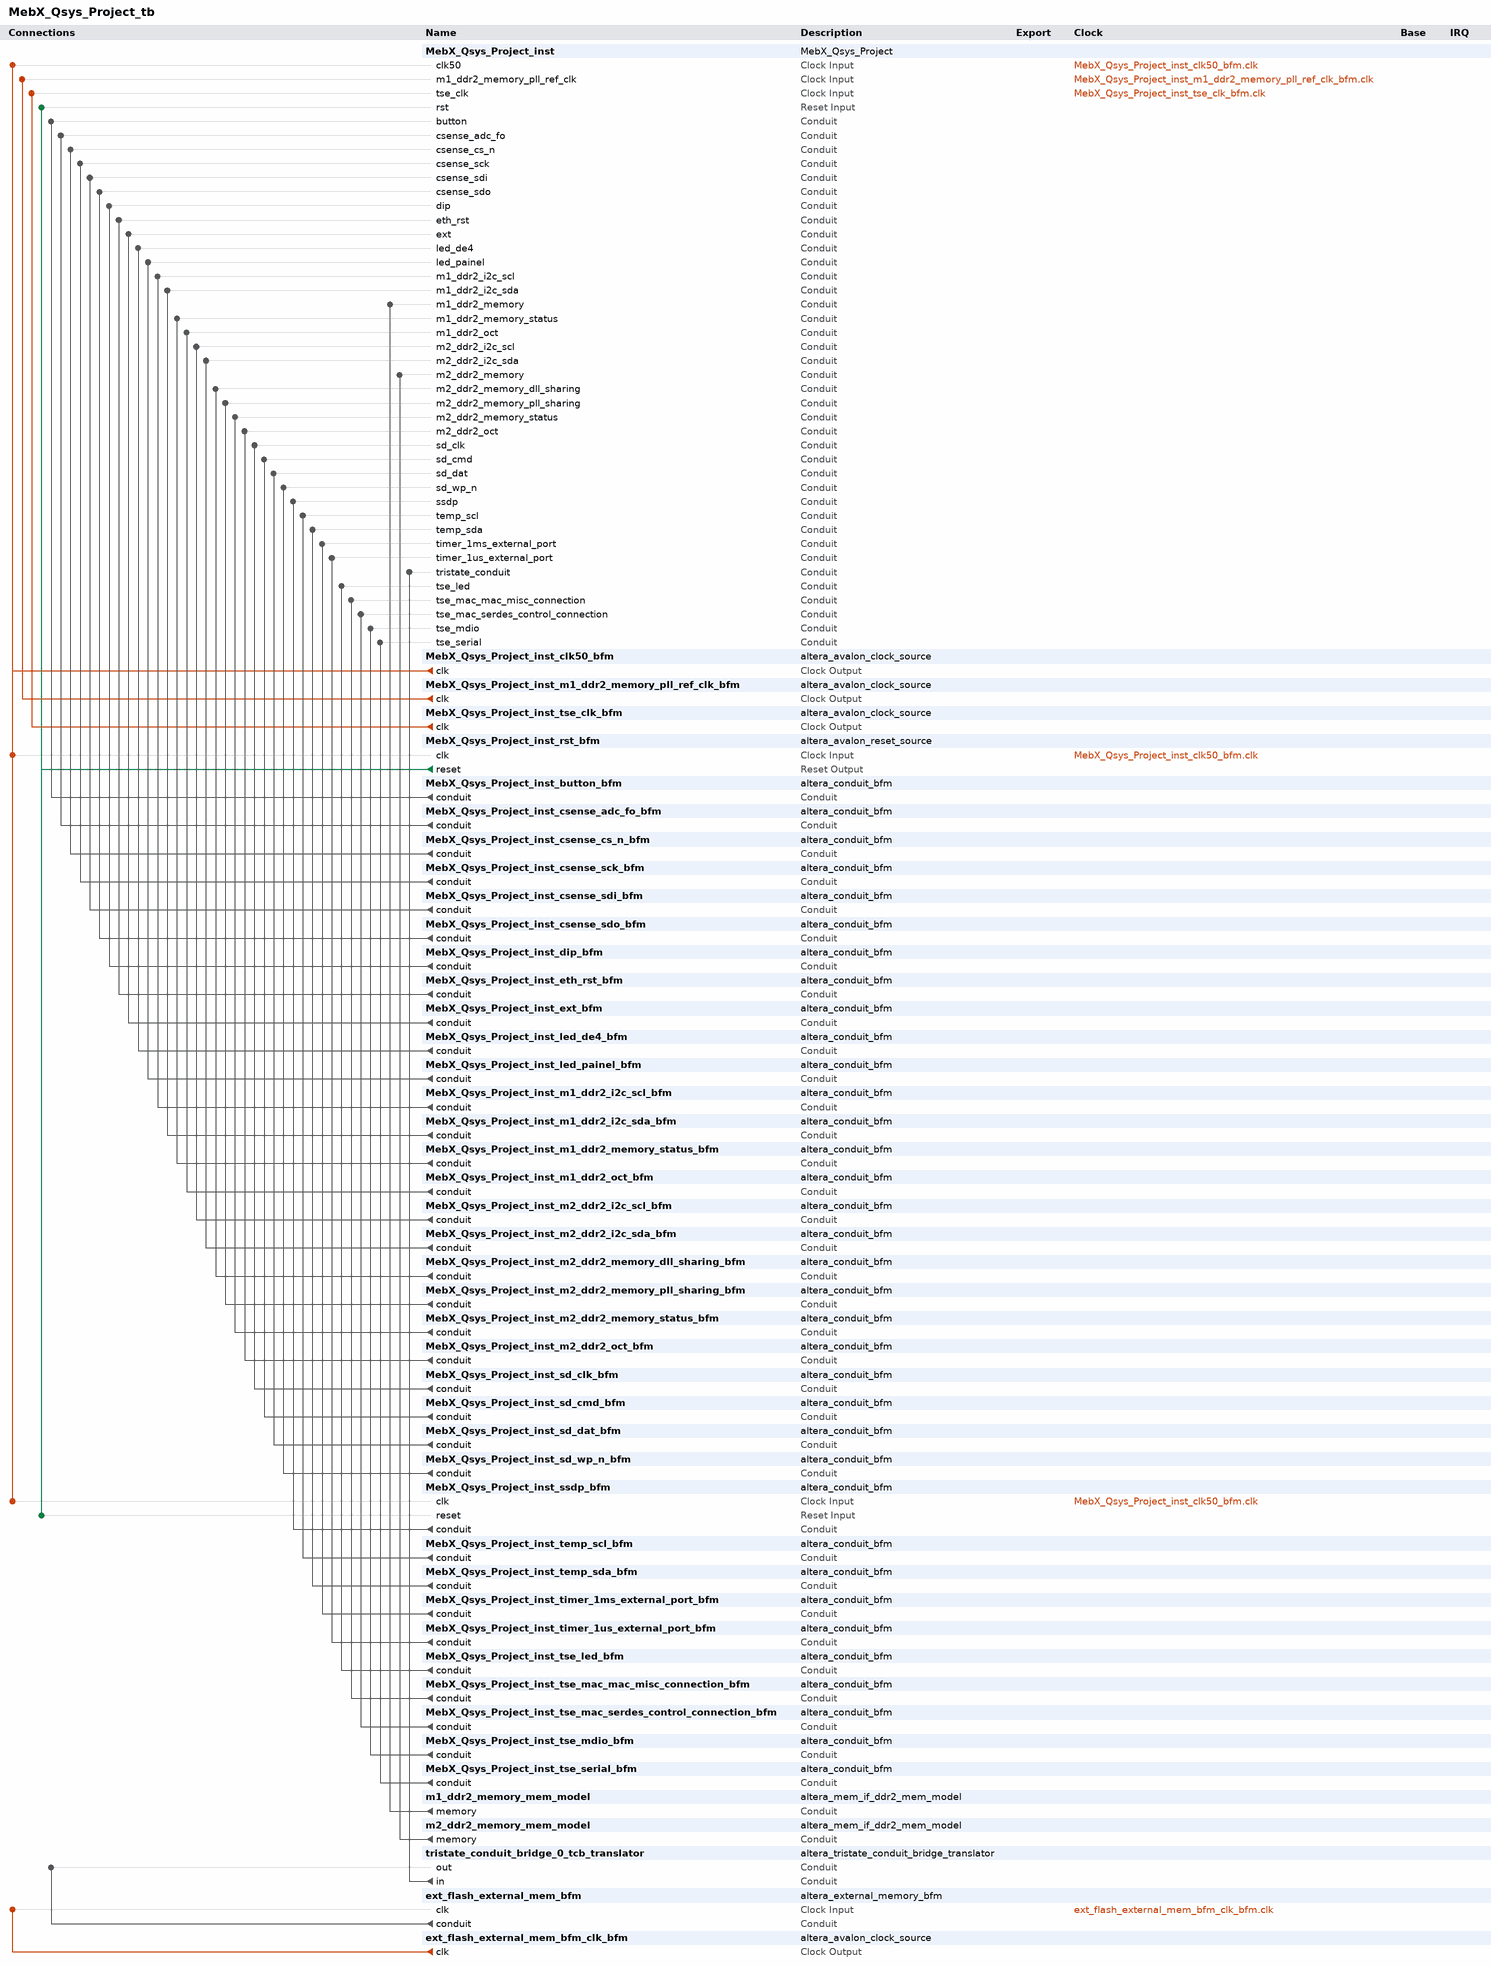
[diagram p0: system contents]
# Platform Designer (Qsys) system MebX_Qsys_Project_tb, Stratix IV EP4SGX230KF40C2
# Parameters at their usual value, and those the tool derives, are not listed.
package require -exact qsys 16.1
create_system MebX_Qsys_Project_tb
set_project_property DEVICE_FAMILY {Stratix IV}
set_project_property DEVICE EP4SGX230KF40C2

add_instance MebX_Qsys_Project_inst MebX_Qsys_Project 1.0

add_instance MebX_Qsys_Project_inst_clk50_bfm altera_avalon_clock_source 16.1

add_instance MebX_Qsys_Project_inst_m1_ddr2_memory_pll_ref_clk_bfm altera_avalon_clock_source 16.1

add_instance MebX_Qsys_Project_inst_tse_clk_bfm altera_avalon_clock_source 16.1

add_instance MebX_Qsys_Project_inst_rst_bfm altera_avalon_reset_source 16.1
set_instance_parameter_value MebX_Qsys_Project_inst_rst_bfm ASSERT_HIGH_RESET 0
set_instance_parameter_value MebX_Qsys_Project_inst_rst_bfm INITIAL_RESET_CYCLES 50

add_instance MebX_Qsys_Project_inst_button_bfm altera_conduit_bfm 16.1
set_instance_parameter_value MebX_Qsys_Project_inst_button_bfm CLOCKED_SIGNAL false
set_instance_parameter_value MebX_Qsys_Project_inst_button_bfm ENABLE_RESET false
set_instance_parameter_value MebX_Qsys_Project_inst_button_bfm SIGNAL_DIRECTIONS output
set_instance_parameter_value MebX_Qsys_Project_inst_button_bfm SIGNAL_WIDTHS 4

add_instance MebX_Qsys_Project_inst_csense_adc_fo_bfm altera_conduit_bfm 16.1
set_instance_parameter_value MebX_Qsys_Project_inst_csense_adc_fo_bfm CLOCKED_SIGNAL false
set_instance_parameter_value MebX_Qsys_Project_inst_csense_adc_fo_bfm ENABLE_RESET false
set_instance_parameter_value MebX_Qsys_Project_inst_csense_adc_fo_bfm SIGNAL_DIRECTIONS input
set_instance_parameter_value MebX_Qsys_Project_inst_csense_adc_fo_bfm SIGNAL_WIDTHS 1

add_instance MebX_Qsys_Project_inst_csense_cs_n_bfm altera_conduit_bfm 16.1
set_instance_parameter_value MebX_Qsys_Project_inst_csense_cs_n_bfm CLOCKED_SIGNAL false
set_instance_parameter_value MebX_Qsys_Project_inst_csense_cs_n_bfm ENABLE_RESET false
set_instance_parameter_value MebX_Qsys_Project_inst_csense_cs_n_bfm SIGNAL_DIRECTIONS input
set_instance_parameter_value MebX_Qsys_Project_inst_csense_cs_n_bfm SIGNAL_WIDTHS 2

add_instance MebX_Qsys_Project_inst_csense_sck_bfm altera_conduit_bfm 16.1
set_instance_parameter_value MebX_Qsys_Project_inst_csense_sck_bfm CLOCKED_SIGNAL false
set_instance_parameter_value MebX_Qsys_Project_inst_csense_sck_bfm ENABLE_RESET false
set_instance_parameter_value MebX_Qsys_Project_inst_csense_sck_bfm SIGNAL_DIRECTIONS input
set_instance_parameter_value MebX_Qsys_Project_inst_csense_sck_bfm SIGNAL_WIDTHS 1

add_instance MebX_Qsys_Project_inst_csense_sdi_bfm altera_conduit_bfm 16.1
set_instance_parameter_value MebX_Qsys_Project_inst_csense_sdi_bfm CLOCKED_SIGNAL false
set_instance_parameter_value MebX_Qsys_Project_inst_csense_sdi_bfm ENABLE_RESET false
set_instance_parameter_value MebX_Qsys_Project_inst_csense_sdi_bfm SIGNAL_DIRECTIONS input
set_instance_parameter_value MebX_Qsys_Project_inst_csense_sdi_bfm SIGNAL_WIDTHS 1

add_instance MebX_Qsys_Project_inst_csense_sdo_bfm altera_conduit_bfm 16.1
set_instance_parameter_value MebX_Qsys_Project_inst_csense_sdo_bfm CLOCKED_SIGNAL false
set_instance_parameter_value MebX_Qsys_Project_inst_csense_sdo_bfm ENABLE_RESET false
set_instance_parameter_value MebX_Qsys_Project_inst_csense_sdo_bfm SIGNAL_DIRECTIONS output
set_instance_parameter_value MebX_Qsys_Project_inst_csense_sdo_bfm SIGNAL_WIDTHS 1

add_instance MebX_Qsys_Project_inst_dip_bfm altera_conduit_bfm 16.1
set_instance_parameter_value MebX_Qsys_Project_inst_dip_bfm CLOCKED_SIGNAL false
set_instance_parameter_value MebX_Qsys_Project_inst_dip_bfm ENABLE_RESET false
set_instance_parameter_value MebX_Qsys_Project_inst_dip_bfm SIGNAL_DIRECTIONS output
set_instance_parameter_value MebX_Qsys_Project_inst_dip_bfm SIGNAL_WIDTHS 8

add_instance MebX_Qsys_Project_inst_eth_rst_bfm altera_conduit_bfm 16.1
set_instance_parameter_value MebX_Qsys_Project_inst_eth_rst_bfm CLOCKED_SIGNAL false
set_instance_parameter_value MebX_Qsys_Project_inst_eth_rst_bfm ENABLE_RESET false
set_instance_parameter_value MebX_Qsys_Project_inst_eth_rst_bfm SIGNAL_DIRECTIONS input
set_instance_parameter_value MebX_Qsys_Project_inst_eth_rst_bfm SIGNAL_WIDTHS 1

add_instance MebX_Qsys_Project_inst_ext_bfm altera_conduit_bfm 16.1
set_instance_parameter_value MebX_Qsys_Project_inst_ext_bfm CLOCKED_SIGNAL false
set_instance_parameter_value MebX_Qsys_Project_inst_ext_bfm ENABLE_RESET false
set_instance_parameter_value MebX_Qsys_Project_inst_ext_bfm SIGNAL_DIRECTIONS output
set_instance_parameter_value MebX_Qsys_Project_inst_ext_bfm SIGNAL_WIDTHS 1

add_instance MebX_Qsys_Project_inst_led_de4_bfm altera_conduit_bfm 16.1
set_instance_parameter_value MebX_Qsys_Project_inst_led_de4_bfm CLOCKED_SIGNAL false
set_instance_parameter_value MebX_Qsys_Project_inst_led_de4_bfm ENABLE_RESET false
set_instance_parameter_value MebX_Qsys_Project_inst_led_de4_bfm SIGNAL_DIRECTIONS input
set_instance_parameter_value MebX_Qsys_Project_inst_led_de4_bfm SIGNAL_WIDTHS 8

add_instance MebX_Qsys_Project_inst_led_painel_bfm altera_conduit_bfm 16.1
set_instance_parameter_value MebX_Qsys_Project_inst_led_painel_bfm CLOCKED_SIGNAL false
set_instance_parameter_value MebX_Qsys_Project_inst_led_painel_bfm ENABLE_RESET false
set_instance_parameter_value MebX_Qsys_Project_inst_led_painel_bfm SIGNAL_DIRECTIONS input
set_instance_parameter_value MebX_Qsys_Project_inst_led_painel_bfm SIGNAL_WIDTHS 13

add_instance MebX_Qsys_Project_inst_m1_ddr2_i2c_scl_bfm altera_conduit_bfm 16.1
set_instance_parameter_value MebX_Qsys_Project_inst_m1_ddr2_i2c_scl_bfm CLOCKED_SIGNAL false
set_instance_parameter_value MebX_Qsys_Project_inst_m1_ddr2_i2c_scl_bfm ENABLE_RESET false
set_instance_parameter_value MebX_Qsys_Project_inst_m1_ddr2_i2c_scl_bfm SIGNAL_DIRECTIONS input
set_instance_parameter_value MebX_Qsys_Project_inst_m1_ddr2_i2c_scl_bfm SIGNAL_WIDTHS 1

add_instance MebX_Qsys_Project_inst_m1_ddr2_i2c_sda_bfm altera_conduit_bfm 16.1
set_instance_parameter_value MebX_Qsys_Project_inst_m1_ddr2_i2c_sda_bfm CLOCKED_SIGNAL false
set_instance_parameter_value MebX_Qsys_Project_inst_m1_ddr2_i2c_sda_bfm ENABLE_RESET false
set_instance_parameter_value MebX_Qsys_Project_inst_m1_ddr2_i2c_sda_bfm SIGNAL_DIRECTIONS bidir
set_instance_parameter_value MebX_Qsys_Project_inst_m1_ddr2_i2c_sda_bfm SIGNAL_WIDTHS 1

add_instance MebX_Qsys_Project_inst_m1_ddr2_memory_status_bfm altera_conduit_bfm 16.1
set_instance_parameter_value MebX_Qsys_Project_inst_m1_ddr2_memory_status_bfm CLOCKED_SIGNAL false
set_instance_parameter_value MebX_Qsys_Project_inst_m1_ddr2_memory_status_bfm ENABLE_RESET false
set_instance_parameter_value MebX_Qsys_Project_inst_m1_ddr2_memory_status_bfm SIGNAL_DIRECTIONS input,input,input
set_instance_parameter_value MebX_Qsys_Project_inst_m1_ddr2_memory_status_bfm SIGNAL_ROLES local_init_done,local_cal_success,local_cal_fail
set_instance_parameter_value MebX_Qsys_Project_inst_m1_ddr2_memory_status_bfm SIGNAL_WIDTHS 1,1,1

add_instance MebX_Qsys_Project_inst_m1_ddr2_oct_bfm altera_conduit_bfm 16.1
set_instance_parameter_value MebX_Qsys_Project_inst_m1_ddr2_oct_bfm CLOCKED_SIGNAL false
set_instance_parameter_value MebX_Qsys_Project_inst_m1_ddr2_oct_bfm ENABLE_RESET false
set_instance_parameter_value MebX_Qsys_Project_inst_m1_ddr2_oct_bfm SIGNAL_DIRECTIONS output,output
set_instance_parameter_value MebX_Qsys_Project_inst_m1_ddr2_oct_bfm SIGNAL_ROLES rdn,rup
set_instance_parameter_value MebX_Qsys_Project_inst_m1_ddr2_oct_bfm SIGNAL_WIDTHS 1,1

add_instance MebX_Qsys_Project_inst_m2_ddr2_i2c_scl_bfm altera_conduit_bfm 16.1
set_instance_parameter_value MebX_Qsys_Project_inst_m2_ddr2_i2c_scl_bfm CLOCKED_SIGNAL false
set_instance_parameter_value MebX_Qsys_Project_inst_m2_ddr2_i2c_scl_bfm ENABLE_RESET false
set_instance_parameter_value MebX_Qsys_Project_inst_m2_ddr2_i2c_scl_bfm SIGNAL_DIRECTIONS input
set_instance_parameter_value MebX_Qsys_Project_inst_m2_ddr2_i2c_scl_bfm SIGNAL_WIDTHS 1

add_instance MebX_Qsys_Project_inst_m2_ddr2_i2c_sda_bfm altera_conduit_bfm 16.1
set_instance_parameter_value MebX_Qsys_Project_inst_m2_ddr2_i2c_sda_bfm CLOCKED_SIGNAL false
set_instance_parameter_value MebX_Qsys_Project_inst_m2_ddr2_i2c_sda_bfm ENABLE_RESET false
set_instance_parameter_value MebX_Qsys_Project_inst_m2_ddr2_i2c_sda_bfm SIGNAL_DIRECTIONS bidir
set_instance_parameter_value MebX_Qsys_Project_inst_m2_ddr2_i2c_sda_bfm SIGNAL_WIDTHS 1

add_instance MebX_Qsys_Project_inst_m2_ddr2_memory_dll_sharing_bfm altera_conduit_bfm 16.1
set_instance_parameter_value MebX_Qsys_Project_inst_m2_ddr2_memory_dll_sharing_bfm CLOCKED_SIGNAL false
set_instance_parameter_value MebX_Qsys_Project_inst_m2_ddr2_memory_dll_sharing_bfm ENABLE_RESET false
set_instance_parameter_value MebX_Qsys_Project_inst_m2_ddr2_memory_dll_sharing_bfm SIGNAL_DIRECTIONS output,input
set_instance_parameter_value MebX_Qsys_Project_inst_m2_ddr2_memory_dll_sharing_bfm SIGNAL_ROLES dll_pll_locked,dll_delayctrl
set_instance_parameter_value MebX_Qsys_Project_inst_m2_ddr2_memory_dll_sharing_bfm SIGNAL_WIDTHS 1,6

add_instance MebX_Qsys_Project_inst_m2_ddr2_memory_pll_sharing_bfm altera_conduit_bfm 16.1
set_instance_parameter_value MebX_Qsys_Project_inst_m2_ddr2_memory_pll_sharing_bfm CLOCKED_SIGNAL false
set_instance_parameter_value MebX_Qsys_Project_inst_m2_ddr2_memory_pll_sharing_bfm ENABLE_RESET false
set_instance_parameter_value MebX_Qsys_Project_inst_m2_ddr2_memory_pll_sharing_bfm SIGNAL_DIRECTIONS input,input,input,input,input,input,input
set_instance_parameter_value MebX_Qsys_Project_inst_m2_ddr2_memory_pll_sharing_bfm SIGNAL_ROLES pll_mem_clk,pll_write_clk,pll_locked,pll_write_clk_pre_phy_clk,pll_addr_cmd_clk,pll_avl_clk,pll_config_clk
set_instance_parameter_value MebX_Qsys_Project_inst_m2_ddr2_memory_pll_sharing_bfm SIGNAL_WIDTHS 1,1,1,1,1,1,1

add_instance MebX_Qsys_Project_inst_m2_ddr2_memory_status_bfm altera_conduit_bfm 16.1
set_instance_parameter_value MebX_Qsys_Project_inst_m2_ddr2_memory_status_bfm CLOCKED_SIGNAL false
set_instance_parameter_value MebX_Qsys_Project_inst_m2_ddr2_memory_status_bfm ENABLE_RESET false
set_instance_parameter_value MebX_Qsys_Project_inst_m2_ddr2_memory_status_bfm SIGNAL_DIRECTIONS input,input,input
set_instance_parameter_value MebX_Qsys_Project_inst_m2_ddr2_memory_status_bfm SIGNAL_ROLES local_init_done,local_cal_success,local_cal_fail
set_instance_parameter_value MebX_Qsys_Project_inst_m2_ddr2_memory_status_bfm SIGNAL_WIDTHS 1,1,1

add_instance MebX_Qsys_Project_inst_m2_ddr2_oct_bfm altera_conduit_bfm 16.1
set_instance_parameter_value MebX_Qsys_Project_inst_m2_ddr2_oct_bfm CLOCKED_SIGNAL false
set_instance_parameter_value MebX_Qsys_Project_inst_m2_ddr2_oct_bfm ENABLE_RESET false
set_instance_parameter_value MebX_Qsys_Project_inst_m2_ddr2_oct_bfm SIGNAL_DIRECTIONS output,output
set_instance_parameter_value MebX_Qsys_Project_inst_m2_ddr2_oct_bfm SIGNAL_ROLES rdn,rup
set_instance_parameter_value MebX_Qsys_Project_inst_m2_ddr2_oct_bfm SIGNAL_WIDTHS 1,1

add_instance MebX_Qsys_Project_inst_sd_clk_bfm altera_conduit_bfm 16.1
set_instance_parameter_value MebX_Qsys_Project_inst_sd_clk_bfm CLOCKED_SIGNAL false
set_instance_parameter_value MebX_Qsys_Project_inst_sd_clk_bfm ENABLE_RESET false
set_instance_parameter_value MebX_Qsys_Project_inst_sd_clk_bfm SIGNAL_DIRECTIONS input
set_instance_parameter_value MebX_Qsys_Project_inst_sd_clk_bfm SIGNAL_WIDTHS 1

add_instance MebX_Qsys_Project_inst_sd_cmd_bfm altera_conduit_bfm 16.1
set_instance_parameter_value MebX_Qsys_Project_inst_sd_cmd_bfm CLOCKED_SIGNAL false
set_instance_parameter_value MebX_Qsys_Project_inst_sd_cmd_bfm ENABLE_RESET false
set_instance_parameter_value MebX_Qsys_Project_inst_sd_cmd_bfm SIGNAL_DIRECTIONS bidir
set_instance_parameter_value MebX_Qsys_Project_inst_sd_cmd_bfm SIGNAL_WIDTHS 1

add_instance MebX_Qsys_Project_inst_sd_dat_bfm altera_conduit_bfm 16.1
set_instance_parameter_value MebX_Qsys_Project_inst_sd_dat_bfm CLOCKED_SIGNAL false
set_instance_parameter_value MebX_Qsys_Project_inst_sd_dat_bfm ENABLE_RESET false
set_instance_parameter_value MebX_Qsys_Project_inst_sd_dat_bfm SIGNAL_DIRECTIONS bidir
set_instance_parameter_value MebX_Qsys_Project_inst_sd_dat_bfm SIGNAL_WIDTHS 4

add_instance MebX_Qsys_Project_inst_sd_wp_n_bfm altera_conduit_bfm 16.1
set_instance_parameter_value MebX_Qsys_Project_inst_sd_wp_n_bfm CLOCKED_SIGNAL false
set_instance_parameter_value MebX_Qsys_Project_inst_sd_wp_n_bfm ENABLE_RESET false
set_instance_parameter_value MebX_Qsys_Project_inst_sd_wp_n_bfm SIGNAL_DIRECTIONS output
set_instance_parameter_value MebX_Qsys_Project_inst_sd_wp_n_bfm SIGNAL_WIDTHS 1

add_instance MebX_Qsys_Project_inst_ssdp_bfm altera_conduit_bfm 16.1
set_instance_parameter_value MebX_Qsys_Project_inst_ssdp_bfm CLOCKED_SIGNAL true
set_instance_parameter_value MebX_Qsys_Project_inst_ssdp_bfm ENABLE_RESET true
set_instance_parameter_value MebX_Qsys_Project_inst_ssdp_bfm SIGNAL_DIRECTIONS input,input
set_instance_parameter_value MebX_Qsys_Project_inst_ssdp_bfm SIGNAL_ROLES ssdp0,ssdp1
set_instance_parameter_value MebX_Qsys_Project_inst_ssdp_bfm SIGNAL_WIDTHS 8,8

add_instance MebX_Qsys_Project_inst_temp_scl_bfm altera_conduit_bfm 16.1
set_instance_parameter_value MebX_Qsys_Project_inst_temp_scl_bfm CLOCKED_SIGNAL false
set_instance_parameter_value MebX_Qsys_Project_inst_temp_scl_bfm ENABLE_RESET false
set_instance_parameter_value MebX_Qsys_Project_inst_temp_scl_bfm SIGNAL_DIRECTIONS input
set_instance_parameter_value MebX_Qsys_Project_inst_temp_scl_bfm SIGNAL_WIDTHS 1

add_instance MebX_Qsys_Project_inst_temp_sda_bfm altera_conduit_bfm 16.1
set_instance_parameter_value MebX_Qsys_Project_inst_temp_sda_bfm CLOCKED_SIGNAL false
set_instance_parameter_value MebX_Qsys_Project_inst_temp_sda_bfm ENABLE_RESET false
set_instance_parameter_value MebX_Qsys_Project_inst_temp_sda_bfm SIGNAL_DIRECTIONS bidir
set_instance_parameter_value MebX_Qsys_Project_inst_temp_sda_bfm SIGNAL_WIDTHS 1

add_instance MebX_Qsys_Project_inst_timer_1ms_external_port_bfm altera_conduit_bfm 16.1
set_instance_parameter_value MebX_Qsys_Project_inst_timer_1ms_external_port_bfm CLOCKED_SIGNAL false
set_instance_parameter_value MebX_Qsys_Project_inst_timer_1ms_external_port_bfm ENABLE_RESET false
set_instance_parameter_value MebX_Qsys_Project_inst_timer_1ms_external_port_bfm SIGNAL_DIRECTIONS input
set_instance_parameter_value MebX_Qsys_Project_inst_timer_1ms_external_port_bfm SIGNAL_WIDTHS 1

add_instance MebX_Qsys_Project_inst_timer_1us_external_port_bfm altera_conduit_bfm 16.1
set_instance_parameter_value MebX_Qsys_Project_inst_timer_1us_external_port_bfm CLOCKED_SIGNAL false
set_instance_parameter_value MebX_Qsys_Project_inst_timer_1us_external_port_bfm ENABLE_RESET false
set_instance_parameter_value MebX_Qsys_Project_inst_timer_1us_external_port_bfm SIGNAL_DIRECTIONS input
set_instance_parameter_value MebX_Qsys_Project_inst_timer_1us_external_port_bfm SIGNAL_WIDTHS 1

add_instance MebX_Qsys_Project_inst_tse_led_bfm altera_conduit_bfm 16.1
set_instance_parameter_value MebX_Qsys_Project_inst_tse_led_bfm CLOCKED_SIGNAL false
set_instance_parameter_value MebX_Qsys_Project_inst_tse_led_bfm ENABLE_RESET false
set_instance_parameter_value MebX_Qsys_Project_inst_tse_led_bfm SIGNAL_DIRECTIONS input,input,input,input,input,input,input
set_instance_parameter_value MebX_Qsys_Project_inst_tse_led_bfm SIGNAL_ROLES crs,link,panel_link,col,an,char_err,disp_err
set_instance_parameter_value MebX_Qsys_Project_inst_tse_led_bfm SIGNAL_WIDTHS 1,1,1,1,1,1,1

add_instance MebX_Qsys_Project_inst_tse_mac_mac_misc_connection_bfm altera_conduit_bfm 16.1
set_instance_parameter_value MebX_Qsys_Project_inst_tse_mac_mac_misc_connection_bfm CLOCKED_SIGNAL false
set_instance_parameter_value MebX_Qsys_Project_inst_tse_mac_mac_misc_connection_bfm ENABLE_RESET false
set_instance_parameter_value MebX_Qsys_Project_inst_tse_mac_mac_misc_connection_bfm SIGNAL_DIRECTIONS output,output,input,output,output,input,input,input,input,input,input,input,input,input
set_instance_parameter_value MebX_Qsys_Project_inst_tse_mac_mac_misc_connection_bfm SIGNAL_ROLES xon_gen,xoff_gen,magic_wakeup,magic_sleep_n,ff_tx_crc_fwd,ff_tx_septy,tx_ff_uflow,ff_tx_a_full,ff_tx_a_empty,rx_err_stat,rx_frm_type,ff_rx_dsav,ff_rx_a_full,ff_rx_a_empty
set_instance_parameter_value MebX_Qsys_Project_inst_tse_mac_mac_misc_connection_bfm SIGNAL_WIDTHS 1,1,1,1,1,1,1,1,1,18,4,1,1,1

add_instance MebX_Qsys_Project_inst_tse_mac_serdes_control_connection_bfm altera_conduit_bfm 16.1
set_instance_parameter_value MebX_Qsys_Project_inst_tse_mac_serdes_control_connection_bfm CLOCKED_SIGNAL false
set_instance_parameter_value MebX_Qsys_Project_inst_tse_mac_serdes_control_connection_bfm ENABLE_RESET false
set_instance_parameter_value MebX_Qsys_Project_inst_tse_mac_serdes_control_connection_bfm SIGNAL_DIRECTIONS input
set_instance_parameter_value MebX_Qsys_Project_inst_tse_mac_serdes_control_connection_bfm SIGNAL_WIDTHS 1

add_instance MebX_Qsys_Project_inst_tse_mdio_bfm altera_conduit_bfm 16.1
set_instance_parameter_value MebX_Qsys_Project_inst_tse_mdio_bfm CLOCKED_SIGNAL false
set_instance_parameter_value MebX_Qsys_Project_inst_tse_mdio_bfm ENABLE_RESET false
set_instance_parameter_value MebX_Qsys_Project_inst_tse_mdio_bfm SIGNAL_DIRECTIONS input,output,input,input
set_instance_parameter_value MebX_Qsys_Project_inst_tse_mdio_bfm SIGNAL_ROLES mdc,mdio_in,mdio_out,mdio_oen
set_instance_parameter_value MebX_Qsys_Project_inst_tse_mdio_bfm SIGNAL_WIDTHS 1,1,1,1

add_instance MebX_Qsys_Project_inst_tse_serial_bfm altera_conduit_bfm 16.1
set_instance_parameter_value MebX_Qsys_Project_inst_tse_serial_bfm CLOCKED_SIGNAL false
set_instance_parameter_value MebX_Qsys_Project_inst_tse_serial_bfm ENABLE_RESET false
set_instance_parameter_value MebX_Qsys_Project_inst_tse_serial_bfm SIGNAL_DIRECTIONS input,output
set_instance_parameter_value MebX_Qsys_Project_inst_tse_serial_bfm SIGNAL_ROLES txp,rxp
set_instance_parameter_value MebX_Qsys_Project_inst_tse_serial_bfm SIGNAL_WIDTHS 1,1

add_instance m1_ddr2_memory_mem_model altera_mem_if_ddr2_mem_model 16.1
set_instance_parameter_value m1_ddr2_memory_mem_model ALTMEMPHY_COMPATIBLE_MODE false
set_instance_parameter_value m1_ddr2_memory_mem_model AP_MODE false
set_instance_parameter_value m1_ddr2_memory_mem_model AP_MODE_EN 0
set_instance_parameter_value m1_ddr2_memory_mem_model CFG_TCCD_NS 2.5
set_instance_parameter_value m1_ddr2_memory_mem_model CUT_NEW_FAMILY_TIMING true
set_instance_parameter_value m1_ddr2_memory_mem_model DAT_DATA_WIDTH 32
set_instance_parameter_value m1_ddr2_memory_mem_model DEVICE_DEPTH 1
set_instance_parameter_value m1_ddr2_memory_mem_model DISABLE_CHILD_MESSAGING false
set_instance_parameter_value m1_ddr2_memory_mem_model DISCRETE_FLY_BY true
set_instance_parameter_value m1_ddr2_memory_mem_model DUPLICATE_AC false
set_instance_parameter_value m1_ddr2_memory_mem_model FORCE_DQS_TRACKING AUTO
set_instance_parameter_value m1_ddr2_memory_mem_model FORCE_SHADOW_REGS AUTO
set_instance_parameter_value m1_ddr2_memory_mem_model HARD_EMIF false
set_instance_parameter_value m1_ddr2_memory_mem_model HHP_HPS false
set_instance_parameter_value m1_ddr2_memory_mem_model HHP_HPS_SIMULATION false
set_instance_parameter_value m1_ddr2_memory_mem_model HHP_HPS_VERIFICATION false
set_instance_parameter_value m1_ddr2_memory_mem_model HPS_PROTOCOL DEFAULT
set_instance_parameter_value m1_ddr2_memory_mem_model IS_ES_DEVICE false
set_instance_parameter_value m1_ddr2_memory_mem_model MEM_ASR Manual
set_instance_parameter_value m1_ddr2_memory_mem_model MEM_ATCL 0
set_instance_parameter_value m1_ddr2_memory_mem_model MEM_AUTO_LEVELING_MODE true
set_instance_parameter_value m1_ddr2_memory_mem_model MEM_BANKADDR_WIDTH 3
set_instance_parameter_value m1_ddr2_memory_mem_model MEM_BL 8
set_instance_parameter_value m1_ddr2_memory_mem_model MEM_BT Sequential
set_instance_parameter_value m1_ddr2_memory_mem_model MEM_CK_WIDTH 2
set_instance_parameter_value m1_ddr2_memory_mem_model MEM_CLK_EN_WIDTH 1
set_instance_parameter_value m1_ddr2_memory_mem_model MEM_CLK_FREQ 400.0
set_instance_parameter_value m1_ddr2_memory_mem_model MEM_CLK_FREQ_MAX 400.0
set_instance_parameter_value m1_ddr2_memory_mem_model MEM_COL_ADDR_WIDTH 10
set_instance_parameter_value m1_ddr2_memory_mem_model MEM_CS_WIDTH 1
set_instance_parameter_value m1_ddr2_memory_mem_model MEM_DLL_EN true
set_instance_parameter_value m1_ddr2_memory_mem_model MEM_DQ_PER_DQS 8
set_instance_parameter_value m1_ddr2_memory_mem_model MEM_DQ_WIDTH 64
set_instance_parameter_value m1_ddr2_memory_mem_model MEM_DRV_STR Full
set_instance_parameter_value m1_ddr2_memory_mem_model MEM_FORMAT UNBUFFERED
set_instance_parameter_value m1_ddr2_memory_mem_model MEM_GUARANTEED_WRITE_INIT false
set_instance_parameter_value m1_ddr2_memory_mem_model MEM_IF_BOARD_BASE_DELAY 10
set_instance_parameter_value m1_ddr2_memory_mem_model MEM_IF_DM_PINS_EN true
set_instance_parameter_value m1_ddr2_memory_mem_model MEM_IF_DQSN_EN true
set_instance_parameter_value m1_ddr2_memory_mem_model MEM_IF_SIM_VALID_WINDOW 0
set_instance_parameter_value m1_ddr2_memory_mem_model MEM_INIT_EN false
set_instance_parameter_value m1_ddr2_memory_mem_model MEM_MIRROR_ADDRESSING 0
set_instance_parameter_value m1_ddr2_memory_mem_model MEM_NUMBER_OF_DIMMS 1
set_instance_parameter_value m1_ddr2_memory_mem_model MEM_NUMBER_OF_RANKS_PER_DEVICE 1
set_instance_parameter_value m1_ddr2_memory_mem_model MEM_NUMBER_OF_RANKS_PER_DIMM 1
set_instance_parameter_value m1_ddr2_memory_mem_model MEM_PD {Fast exit}
set_instance_parameter_value m1_ddr2_memory_mem_model MEM_RANK_MULTIPLICATION_FACTOR 1
set_instance_parameter_value m1_ddr2_memory_mem_model MEM_ROW_ADDR_WIDTH 14
set_instance_parameter_value m1_ddr2_memory_mem_model MEM_RTT_NOM 50
set_instance_parameter_value m1_ddr2_memory_mem_model MEM_SRT {2x refresh rate}
set_instance_parameter_value m1_ddr2_memory_mem_model MEM_TCL 6
set_instance_parameter_value m1_ddr2_memory_mem_model MEM_TFAW_NS 37.5
set_instance_parameter_value m1_ddr2_memory_mem_model MEM_TINIT_US 200
set_instance_parameter_value m1_ddr2_memory_mem_model MEM_TMRD_CK 5
set_instance_parameter_value m1_ddr2_memory_mem_model MEM_TRAS_NS 40.0
set_instance_parameter_value m1_ddr2_memory_mem_model MEM_TRCD_NS 15.0
set_instance_parameter_value m1_ddr2_memory_mem_model MEM_TREFI_US 7.8
set_instance_parameter_value m1_ddr2_memory_mem_model MEM_TRFC_NS 127.5
set_instance_parameter_value m1_ddr2_memory_mem_model MEM_TRP_NS 15.0
set_instance_parameter_value m1_ddr2_memory_mem_model MEM_TRRD_NS 7.5
set_instance_parameter_value m1_ddr2_memory_mem_model MEM_TRTP_NS 7.5
set_instance_parameter_value m1_ddr2_memory_mem_model MEM_TWR_NS 15.0
set_instance_parameter_value m1_ddr2_memory_mem_model MEM_TWTR 3
set_instance_parameter_value m1_ddr2_memory_mem_model MEM_USER_LEVELING_MODE Leveling
set_instance_parameter_value m1_ddr2_memory_mem_model MEM_VENDOR Micron
set_instance_parameter_value m1_ddr2_memory_mem_model MEM_VERBOSE true
set_instance_parameter_value m1_ddr2_memory_mem_model MRS_MIRROR_PING_PONG_ATSO false
set_instance_parameter_value m1_ddr2_memory_mem_model NEXTGEN true
set_instance_parameter_value m1_ddr2_memory_mem_model PARSE_FRIENDLY_DEVICE_FAMILY_PARAM_VALID false
set_instance_parameter_value m1_ddr2_memory_mem_model PINGPONGPHY_EN false
set_instance_parameter_value m1_ddr2_memory_mem_model RATE Half
set_instance_parameter_value m1_ddr2_memory_mem_model REFRESH_BURST_VALIDATION false
set_instance_parameter_value m1_ddr2_memory_mem_model SPEED_GRADE 2
set_instance_parameter_value m1_ddr2_memory_mem_model TIMING_TDH 250
set_instance_parameter_value m1_ddr2_memory_mem_model TIMING_TDQSCK 350
set_instance_parameter_value m1_ddr2_memory_mem_model TIMING_TDQSCKDL 1200
set_instance_parameter_value m1_ddr2_memory_mem_model TIMING_TDQSCKDM 900
set_instance_parameter_value m1_ddr2_memory_mem_model TIMING_TDQSCKDS 450
set_instance_parameter_value m1_ddr2_memory_mem_model TIMING_TDQSH 0.35
set_instance_parameter_value m1_ddr2_memory_mem_model TIMING_TDQSQ 200
set_instance_parameter_value m1_ddr2_memory_mem_model TIMING_TDQSS 0.25
set_instance_parameter_value m1_ddr2_memory_mem_model TIMING_TDS 250
set_instance_parameter_value m1_ddr2_memory_mem_model TIMING_TDSH 0.2
set_instance_parameter_value m1_ddr2_memory_mem_model TIMING_TDSS 0.2
set_instance_parameter_value m1_ddr2_memory_mem_model TIMING_TIH 375
set_instance_parameter_value m1_ddr2_memory_mem_model TIMING_TIS 375
set_instance_parameter_value m1_ddr2_memory_mem_model TIMING_TQHS 300
set_instance_parameter_value m1_ddr2_memory_mem_model USE_MEM_CLK_FREQ false

add_instance m2_ddr2_memory_mem_model altera_mem_if_ddr2_mem_model 16.1
set_instance_parameter_value m2_ddr2_memory_mem_model ALTMEMPHY_COMPATIBLE_MODE false
set_instance_parameter_value m2_ddr2_memory_mem_model AP_MODE false
set_instance_parameter_value m2_ddr2_memory_mem_model AP_MODE_EN 0
set_instance_parameter_value m2_ddr2_memory_mem_model CFG_TCCD_NS 2.5
set_instance_parameter_value m2_ddr2_memory_mem_model CUT_NEW_FAMILY_TIMING true
set_instance_parameter_value m2_ddr2_memory_mem_model DAT_DATA_WIDTH 32
set_instance_parameter_value m2_ddr2_memory_mem_model DEVICE_DEPTH 1
set_instance_parameter_value m2_ddr2_memory_mem_model DISABLE_CHILD_MESSAGING false
set_instance_parameter_value m2_ddr2_memory_mem_model DISCRETE_FLY_BY true
set_instance_parameter_value m2_ddr2_memory_mem_model DUPLICATE_AC false
set_instance_parameter_value m2_ddr2_memory_mem_model FORCE_DQS_TRACKING AUTO
set_instance_parameter_value m2_ddr2_memory_mem_model FORCE_SHADOW_REGS AUTO
set_instance_parameter_value m2_ddr2_memory_mem_model HARD_EMIF false
set_instance_parameter_value m2_ddr2_memory_mem_model HHP_HPS false
set_instance_parameter_value m2_ddr2_memory_mem_model HHP_HPS_SIMULATION false
set_instance_parameter_value m2_ddr2_memory_mem_model HHP_HPS_VERIFICATION false
set_instance_parameter_value m2_ddr2_memory_mem_model HPS_PROTOCOL DEFAULT
set_instance_parameter_value m2_ddr2_memory_mem_model IS_ES_DEVICE false
set_instance_parameter_value m2_ddr2_memory_mem_model MEM_ASR Manual
set_instance_parameter_value m2_ddr2_memory_mem_model MEM_ATCL 0
set_instance_parameter_value m2_ddr2_memory_mem_model MEM_AUTO_LEVELING_MODE true
set_instance_parameter_value m2_ddr2_memory_mem_model MEM_BANKADDR_WIDTH 3
set_instance_parameter_value m2_ddr2_memory_mem_model MEM_BL 8
set_instance_parameter_value m2_ddr2_memory_mem_model MEM_BT Sequential
set_instance_parameter_value m2_ddr2_memory_mem_model MEM_CK_WIDTH 2
set_instance_parameter_value m2_ddr2_memory_mem_model MEM_CLK_EN_WIDTH 1
set_instance_parameter_value m2_ddr2_memory_mem_model MEM_CLK_FREQ 400.0
set_instance_parameter_value m2_ddr2_memory_mem_model MEM_CLK_FREQ_MAX 400.0
set_instance_parameter_value m2_ddr2_memory_mem_model MEM_COL_ADDR_WIDTH 10
set_instance_parameter_value m2_ddr2_memory_mem_model MEM_CS_WIDTH 1
set_instance_parameter_value m2_ddr2_memory_mem_model MEM_DLL_EN true
set_instance_parameter_value m2_ddr2_memory_mem_model MEM_DQ_PER_DQS 8
set_instance_parameter_value m2_ddr2_memory_mem_model MEM_DQ_WIDTH 64
set_instance_parameter_value m2_ddr2_memory_mem_model MEM_DRV_STR Full
set_instance_parameter_value m2_ddr2_memory_mem_model MEM_FORMAT UNBUFFERED
set_instance_parameter_value m2_ddr2_memory_mem_model MEM_GUARANTEED_WRITE_INIT false
set_instance_parameter_value m2_ddr2_memory_mem_model MEM_IF_BOARD_BASE_DELAY 10
set_instance_parameter_value m2_ddr2_memory_mem_model MEM_IF_DM_PINS_EN true
set_instance_parameter_value m2_ddr2_memory_mem_model MEM_IF_DQSN_EN true
set_instance_parameter_value m2_ddr2_memory_mem_model MEM_IF_SIM_VALID_WINDOW 0
set_instance_parameter_value m2_ddr2_memory_mem_model MEM_INIT_EN false
set_instance_parameter_value m2_ddr2_memory_mem_model MEM_MIRROR_ADDRESSING 0
set_instance_parameter_value m2_ddr2_memory_mem_model MEM_NUMBER_OF_DIMMS 1
set_instance_parameter_value m2_ddr2_memory_mem_model MEM_NUMBER_OF_RANKS_PER_DEVICE 1
set_instance_parameter_value m2_ddr2_memory_mem_model MEM_NUMBER_OF_RANKS_PER_DIMM 1
set_instance_parameter_value m2_ddr2_memory_mem_model MEM_PD {Fast exit}
set_instance_parameter_value m2_ddr2_memory_mem_model MEM_RANK_MULTIPLICATION_FACTOR 1
set_instance_parameter_value m2_ddr2_memory_mem_model MEM_ROW_ADDR_WIDTH 14
set_instance_parameter_value m2_ddr2_memory_mem_model MEM_RTT_NOM 50
set_instance_parameter_value m2_ddr2_memory_mem_model MEM_SRT {2x refresh rate}
set_instance_parameter_value m2_ddr2_memory_mem_model MEM_TCL 6
set_instance_parameter_value m2_ddr2_memory_mem_model MEM_TFAW_NS 37.5
set_instance_parameter_value m2_ddr2_memory_mem_model MEM_TINIT_US 200
set_instance_parameter_value m2_ddr2_memory_mem_model MEM_TMRD_CK 5
set_instance_parameter_value m2_ddr2_memory_mem_model MEM_TRAS_NS 40.0
set_instance_parameter_value m2_ddr2_memory_mem_model MEM_TRCD_NS 15.0
set_instance_parameter_value m2_ddr2_memory_mem_model MEM_TREFI_US 7.8
set_instance_parameter_value m2_ddr2_memory_mem_model MEM_TRFC_NS 127.5
set_instance_parameter_value m2_ddr2_memory_mem_model MEM_TRP_NS 15.0
set_instance_parameter_value m2_ddr2_memory_mem_model MEM_TRRD_NS 7.5
set_instance_parameter_value m2_ddr2_memory_mem_model MEM_TRTP_NS 7.5
set_instance_parameter_value m2_ddr2_memory_mem_model MEM_TWR_NS 15.0
set_instance_parameter_value m2_ddr2_memory_mem_model MEM_TWTR 3
set_instance_parameter_value m2_ddr2_memory_mem_model MEM_USER_LEVELING_MODE Leveling
set_instance_parameter_value m2_ddr2_memory_mem_model MEM_VENDOR Micron
set_instance_parameter_value m2_ddr2_memory_mem_model MEM_VERBOSE true
set_instance_parameter_value m2_ddr2_memory_mem_model MRS_MIRROR_PING_PONG_ATSO false
set_instance_parameter_value m2_ddr2_memory_mem_model NEXTGEN true
set_instance_parameter_value m2_ddr2_memory_mem_model PARSE_FRIENDLY_DEVICE_FAMILY_PARAM_VALID false
set_instance_parameter_value m2_ddr2_memory_mem_model PINGPONGPHY_EN false
set_instance_parameter_value m2_ddr2_memory_mem_model RATE Half
set_instance_parameter_value m2_ddr2_memory_mem_model REFRESH_BURST_VALIDATION false
set_instance_parameter_value m2_ddr2_memory_mem_model SPEED_GRADE 2
set_instance_parameter_value m2_ddr2_memory_mem_model TIMING_TDH 250
set_instance_parameter_value m2_ddr2_memory_mem_model TIMING_TDQSCK 350
set_instance_parameter_value m2_ddr2_memory_mem_model TIMING_TDQSCKDL 1200
set_instance_parameter_value m2_ddr2_memory_mem_model TIMING_TDQSCKDM 900
set_instance_parameter_value m2_ddr2_memory_mem_model TIMING_TDQSCKDS 450
set_instance_parameter_value m2_ddr2_memory_mem_model TIMING_TDQSH 0.35
set_instance_parameter_value m2_ddr2_memory_mem_model TIMING_TDQSQ 200
set_instance_parameter_value m2_ddr2_memory_mem_model TIMING_TDQSS 0.25
set_instance_parameter_value m2_ddr2_memory_mem_model TIMING_TDS 250
set_instance_parameter_value m2_ddr2_memory_mem_model TIMING_TDSH 0.2
set_instance_parameter_value m2_ddr2_memory_mem_model TIMING_TDSS 0.2
set_instance_parameter_value m2_ddr2_memory_mem_model TIMING_TIH 375
set_instance_parameter_value m2_ddr2_memory_mem_model TIMING_TIS 375
set_instance_parameter_value m2_ddr2_memory_mem_model TIMING_TQHS 300
set_instance_parameter_value m2_ddr2_memory_mem_model USE_MEM_CLK_FREQ false

add_instance tristate_conduit_bridge_0_tcb_translator altera_tristate_conduit_bridge_translator 16.1
set_instance_parameter_value tristate_conduit_bridge_0_tcb_translator CHAIN_LENGTH 4
set_instance_parameter_value tristate_conduit_bridge_0_tcb_translator MODULE_ORIGIN_LIST ext_flash.tcm,ext_flash.tcm,ext_flash.tcm,ext_flash.tcm,ext_flash.tcm
set_instance_parameter_value tristate_conduit_bridge_0_tcb_translator SIGNAL_ORIGIN_LIST tcm_address_out,tcm_read_n_out,tcm_write_n_out,tcm_data_out,tcm_chipselect_n_out
set_instance_parameter_value tristate_conduit_bridge_0_tcb_translator SIGNAL_ORIGIN_TYPE Output,Output,Output,Bidirectional,Output
set_instance_parameter_value tristate_conduit_bridge_0_tcb_translator SIGNAL_ORIGIN_WIDTH 26,1,1,16,1

add_instance ext_flash_external_mem_bfm altera_external_memory_bfm 16.1
set_instance_parameter_value ext_flash_external_mem_bfm ACTIVE_LOW_BEGINTRANSFER 0
set_instance_parameter_value ext_flash_external_mem_bfm ACTIVE_LOW_BYTEENABLE 0
set_instance_parameter_value ext_flash_external_mem_bfm ACTIVE_LOW_CHIPSELECT 1
set_instance_parameter_value ext_flash_external_mem_bfm ACTIVE_LOW_OUTPUTENABLE 0
set_instance_parameter_value ext_flash_external_mem_bfm ACTIVE_LOW_READ 1
set_instance_parameter_value ext_flash_external_mem_bfm ACTIVE_LOW_RESET 0
set_instance_parameter_value ext_flash_external_mem_bfm ACTIVE_LOW_WRITE 1
set_instance_parameter_value ext_flash_external_mem_bfm CDT_ADDRESS_W 26
set_instance_parameter_value ext_flash_external_mem_bfm CDT_NUMSYMBOLS 2
set_instance_parameter_value ext_flash_external_mem_bfm CDT_READ_LATENCY 0
set_instance_parameter_value ext_flash_external_mem_bfm CDT_SYMBOL_W 8
set_instance_parameter_value ext_flash_external_mem_bfm INIT_FILE altera_external_memory_bfm.hex
set_instance_parameter_value ext_flash_external_mem_bfm SIGNAL_ADDRESS_ROLES tcm_address_out
set_instance_parameter_value ext_flash_external_mem_bfm SIGNAL_BEGINTRANSFER_ROLES tcm_begintransfer_out
set_instance_parameter_value ext_flash_external_mem_bfm SIGNAL_BYTEENABLE_ROLES tcm_byteenable_out
set_instance_parameter_value ext_flash_external_mem_bfm SIGNAL_CHIPSELECT_ROLES tcm_chipselect_n_out
set_instance_parameter_value ext_flash_external_mem_bfm SIGNAL_DATA_ROLES tcm_data_out
set_instance_parameter_value ext_flash_external_mem_bfm SIGNAL_OUTPUTENABLE_ROLES tcm_outputenable_out
set_instance_parameter_value ext_flash_external_mem_bfm SIGNAL_READ_ROLES tcm_read_n_out
set_instance_parameter_value ext_flash_external_mem_bfm SIGNAL_RESET_ROLES tcm_reset_out
set_instance_parameter_value ext_flash_external_mem_bfm SIGNAL_WRITE_ROLES tcm_write_n_out
set_instance_parameter_value ext_flash_external_mem_bfm USE_BEGINTRANSFER 0
set_instance_parameter_value ext_flash_external_mem_bfm USE_BYTEENABLE 0
set_instance_parameter_value ext_flash_external_mem_bfm USE_CHIPSELECT 1
set_instance_parameter_value ext_flash_external_mem_bfm USE_OUTPUTENABLE 0
set_instance_parameter_value ext_flash_external_mem_bfm USE_READ 1
set_instance_parameter_value ext_flash_external_mem_bfm USE_RESET 0
set_instance_parameter_value ext_flash_external_mem_bfm USE_WRITE 1
set_instance_parameter_value ext_flash_external_mem_bfm VHDL_ID 0

add_instance ext_flash_external_mem_bfm_clk_bfm altera_avalon_clock_source 16.1
set_instance_parameter_value ext_flash_external_mem_bfm_clk_bfm CLOCK_RATE 100000000

# connections
add_connection ext_flash_external_mem_bfm_clk_bfm.clk ext_flash_external_mem_bfm.clk clock
add_connection MebX_Qsys_Project_inst_clk50_bfm.clk MebX_Qsys_Project_inst.clk50 clock
add_connection MebX_Qsys_Project_inst_clk50_bfm.clk MebX_Qsys_Project_inst_rst_bfm.clk clock
add_connection MebX_Qsys_Project_inst_clk50_bfm.clk MebX_Qsys_Project_inst_ssdp_bfm.clk clock
add_connection MebX_Qsys_Project_inst_m1_ddr2_memory_pll_ref_clk_bfm.clk MebX_Qsys_Project_inst.m1_ddr2_memory_pll_ref_clk clock
add_connection MebX_Qsys_Project_inst_tse_clk_bfm.clk MebX_Qsys_Project_inst.tse_clk clock
add_connection MebX_Qsys_Project_inst_rst_bfm.reset MebX_Qsys_Project_inst.rst reset
add_connection MebX_Qsys_Project_inst_rst_bfm.reset MebX_Qsys_Project_inst_ssdp_bfm.reset reset
add_connection ext_flash_external_mem_bfm.conduit tristate_conduit_bridge_0_tcb_translator.out conduit
add_connection m1_ddr2_memory_mem_model.memory MebX_Qsys_Project_inst.m1_ddr2_memory conduit
add_connection m2_ddr2_memory_mem_model.memory MebX_Qsys_Project_inst.m2_ddr2_memory conduit
add_connection MebX_Qsys_Project_inst_button_bfm.conduit MebX_Qsys_Project_inst.button conduit
add_connection MebX_Qsys_Project_inst_csense_adc_fo_bfm.conduit MebX_Qsys_Project_inst.csense_adc_fo conduit
add_connection MebX_Qsys_Project_inst_csense_cs_n_bfm.conduit MebX_Qsys_Project_inst.csense_cs_n conduit
add_connection MebX_Qsys_Project_inst_csense_sck_bfm.conduit MebX_Qsys_Project_inst.csense_sck conduit
add_connection MebX_Qsys_Project_inst_csense_sdi_bfm.conduit MebX_Qsys_Project_inst.csense_sdi conduit
add_connection MebX_Qsys_Project_inst_csense_sdo_bfm.conduit MebX_Qsys_Project_inst.csense_sdo conduit
add_connection MebX_Qsys_Project_inst_dip_bfm.conduit MebX_Qsys_Project_inst.dip conduit
add_connection MebX_Qsys_Project_inst_eth_rst_bfm.conduit MebX_Qsys_Project_inst.eth_rst conduit
add_connection MebX_Qsys_Project_inst_ext_bfm.conduit MebX_Qsys_Project_inst.ext conduit
add_connection MebX_Qsys_Project_inst_led_de4_bfm.conduit MebX_Qsys_Project_inst.led_de4 conduit
add_connection MebX_Qsys_Project_inst_led_painel_bfm.conduit MebX_Qsys_Project_inst.led_painel conduit
add_connection MebX_Qsys_Project_inst_m1_ddr2_i2c_scl_bfm.conduit MebX_Qsys_Project_inst.m1_ddr2_i2c_scl conduit
add_connection MebX_Qsys_Project_inst_m1_ddr2_i2c_sda_bfm.conduit MebX_Qsys_Project_inst.m1_ddr2_i2c_sda conduit
add_connection MebX_Qsys_Project_inst_m1_ddr2_memory_status_bfm.conduit MebX_Qsys_Project_inst.m1_ddr2_memory_status conduit
add_connection MebX_Qsys_Project_inst_m1_ddr2_oct_bfm.conduit MebX_Qsys_Project_inst.m1_ddr2_oct conduit
add_connection MebX_Qsys_Project_inst_m2_ddr2_i2c_scl_bfm.conduit MebX_Qsys_Project_inst.m2_ddr2_i2c_scl conduit
add_connection MebX_Qsys_Project_inst_m2_ddr2_i2c_sda_bfm.conduit MebX_Qsys_Project_inst.m2_ddr2_i2c_sda conduit
add_connection MebX_Qsys_Project_inst_m2_ddr2_memory_dll_sharing_bfm.conduit MebX_Qsys_Project_inst.m2_ddr2_memory_dll_sharing conduit
add_connection MebX_Qsys_Project_inst_m2_ddr2_memory_pll_sharing_bfm.conduit MebX_Qsys_Project_inst.m2_ddr2_memory_pll_sharing conduit
add_connection MebX_Qsys_Project_inst_m2_ddr2_memory_status_bfm.conduit MebX_Qsys_Project_inst.m2_ddr2_memory_status conduit
add_connection MebX_Qsys_Project_inst_m2_ddr2_oct_bfm.conduit MebX_Qsys_Project_inst.m2_ddr2_oct conduit
add_connection MebX_Qsys_Project_inst_sd_clk_bfm.conduit MebX_Qsys_Project_inst.sd_clk conduit
add_connection MebX_Qsys_Project_inst_sd_cmd_bfm.conduit MebX_Qsys_Project_inst.sd_cmd conduit
add_connection MebX_Qsys_Project_inst_sd_dat_bfm.conduit MebX_Qsys_Project_inst.sd_dat conduit
add_connection MebX_Qsys_Project_inst_sd_wp_n_bfm.conduit MebX_Qsys_Project_inst.sd_wp_n conduit
add_connection MebX_Qsys_Project_inst_ssdp_bfm.conduit MebX_Qsys_Project_inst.ssdp conduit
add_connection MebX_Qsys_Project_inst_temp_scl_bfm.conduit MebX_Qsys_Project_inst.temp_scl conduit
add_connection MebX_Qsys_Project_inst_temp_sda_bfm.conduit MebX_Qsys_Project_inst.temp_sda conduit
add_connection MebX_Qsys_Project_inst_timer_1ms_external_port_bfm.conduit MebX_Qsys_Project_inst.timer_1ms_external_port conduit
add_connection MebX_Qsys_Project_inst_timer_1us_external_port_bfm.conduit MebX_Qsys_Project_inst.timer_1us_external_port conduit
add_connection MebX_Qsys_Project_inst_tse_led_bfm.conduit MebX_Qsys_Project_inst.tse_led conduit
add_connection MebX_Qsys_Project_inst_tse_mac_mac_misc_connection_bfm.conduit MebX_Qsys_Project_inst.tse_mac_mac_misc_connection conduit
add_connection MebX_Qsys_Project_inst_tse_mac_serdes_control_connection_bfm.conduit MebX_Qsys_Project_inst.tse_mac_serdes_control_connection conduit
add_connection MebX_Qsys_Project_inst_tse_mdio_bfm.conduit MebX_Qsys_Project_inst.tse_mdio conduit
add_connection MebX_Qsys_Project_inst_tse_serial_bfm.conduit MebX_Qsys_Project_inst.tse_serial conduit
add_connection tristate_conduit_bridge_0_tcb_translator.in MebX_Qsys_Project_inst.tristate_conduit conduit

set_interconnect_requirement {$system} qsys_mm.clockCrossingAdapter HANDSHAKE
set_interconnect_requirement {$system} qsys_mm.enableEccProtection FALSE
set_interconnect_requirement {$system} qsys_mm.insertDefaultSlave FALSE
set_interconnect_requirement {$system} qsys_mm.maxAdditionalLatency 1

save_system MebX_Qsys_Project_tb.qsys
